# EAGLE schematic Joystick Module A (EAGLE 8.4.1)
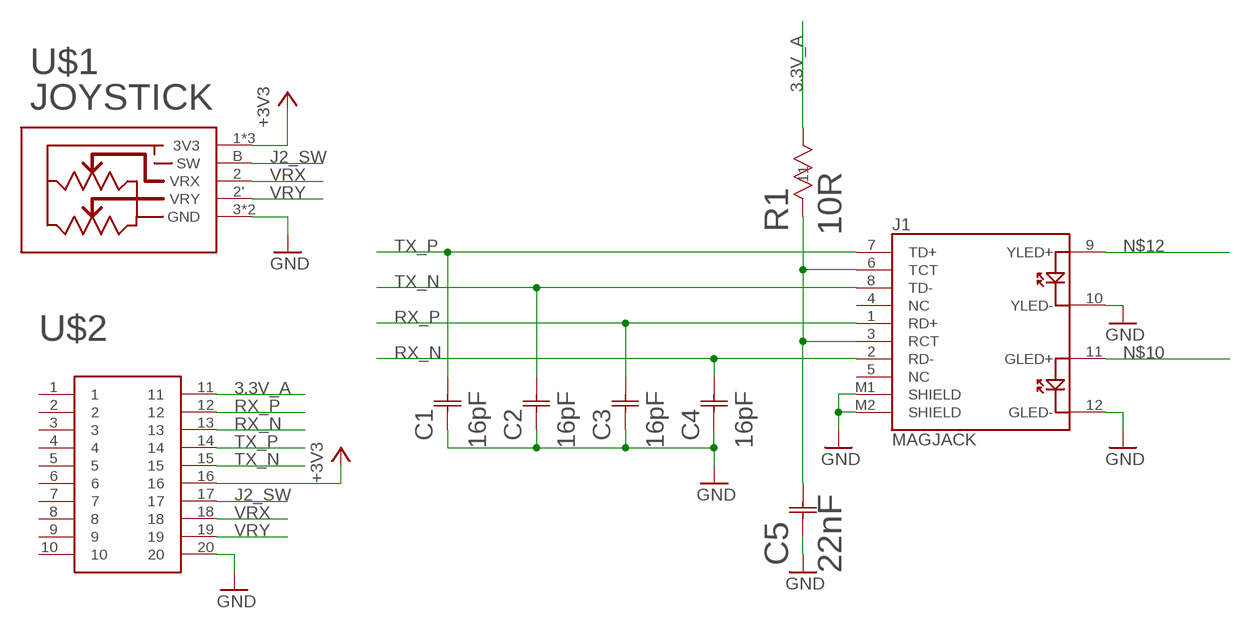
[diagram p0: schematic, sheet 1]

## Parts
C1  16pF  GRM1555C1H160JA01DG-155-M  [G-155-M]
C2  16pF  GRM1555C1H160JA01DG-155-M  [G-155-M]
C3  16pF  GRM1555C1H160JA01DG-155-M  [G-155-M]
C4  16pF  GRM1555C1H160JA01DG-155-M  [G-155-M]
C5  22nF  GRM155R71H223KA12DG-155-M  [G-155-M]
J1  MAGJACK  [MAGJACK]
R1  10R  RNCP0805FTD10R0STA_RNCP0805-M  [STA_RNCP0805-M]
U$1  JOYSTICK"  [JOYSTICK]
U$2  EDGE_CONNECTOR_20POS_CONTACTS  [EDGE_CONNECTOR_20POS_CONTACTS]

## Nets
3.3V_A: R1.2 U$2.11
+3V3: U$1.1'(3V3) U$1.1(3V3) U$1.A(3V3) U$2.16
GND: C1.1 C2.1 C3.1 C4.1 C5.1 J1.10(YLED-) J1.12(GLED-) J1.M1(SHIELD) J1.M2(SHIELD) U$1.3'(GND) U$1.3(GND) U$2.20
J2_SW: U$1.B(SW) U$2.17
N$1: C5.2 J1.3(RCT) J1.6(TCT) R1.1
N$10: J1.11(GLED+)
N$12: J1.9(YLED+)
RX_N: C4.2 J1.2(RD-) U$2.13
RX_P: C3.2 J1.1(RD+) U$2.12
TX_N: C2.2 J1.8(TD-) U$2.15
TX_P: C1.2 J1.7(TD+) U$2.14
VRX: U$1.2(VRX) U$2.18
VRY: U$1.2'(VRY) U$2.19
Unconnected: J1.4(NC) J1.5(NC) U$2.1 U$2.2 U$2.3 U$2.4 U$2.5 U$2.6 U$2.7 U$2.8 U$2.9 U$2.10

## Library data of the parts
C1-C4 = 16pF-capacitor:GRM1555C1H160JA01D; MANUFACTURER_PART_NUMBER: GRM1555C1H160JA01D; VENDOR: Murata
C5 = 22nF-capacitor:GRM155R71H223KA12D; MANUFACTURER_PART_NUMBER: GRM155R71H223KA12D; VENDOR: Murata
J1 = SparkFun-Connectors:MAGJACK: MAGJACK: RJ-45 with LEDs This is a single port, RJ45 ethernet jacks with built in transformer (magnetics), status LEDs, and shielding. Here is the connector we sell at SparkFun: RJ45 Ethernet MagJack-Compatible <https://www.sparkfun.com/products/8534> (PRT-08534) Datasheet <http://www.sparkfun.com/datasheets/Prototyping/MagJack.pdf> It is used on this SparkFun product: SparkFun RJ45 MagJack Breakout <https://www.sparkfun.com/products/13021> (BOB-13021); PROD_ID: CONN-09556; SF_ID: PRT-08534
R1 = 10-resistor:RNCP0805FTD10R0; COPYRIGHT: Copyright C 2015 Accelerated Designs. All rights reserved; MANUFACTURER_PART_NUMBER: RNCP0805FTD10R0; VENDOR: Vendor
U$1 = thanics_robotics:JOYSTICK
U$2 = thanics_robotics:EDGE_CONNECTOR_20POS_CONTACTS